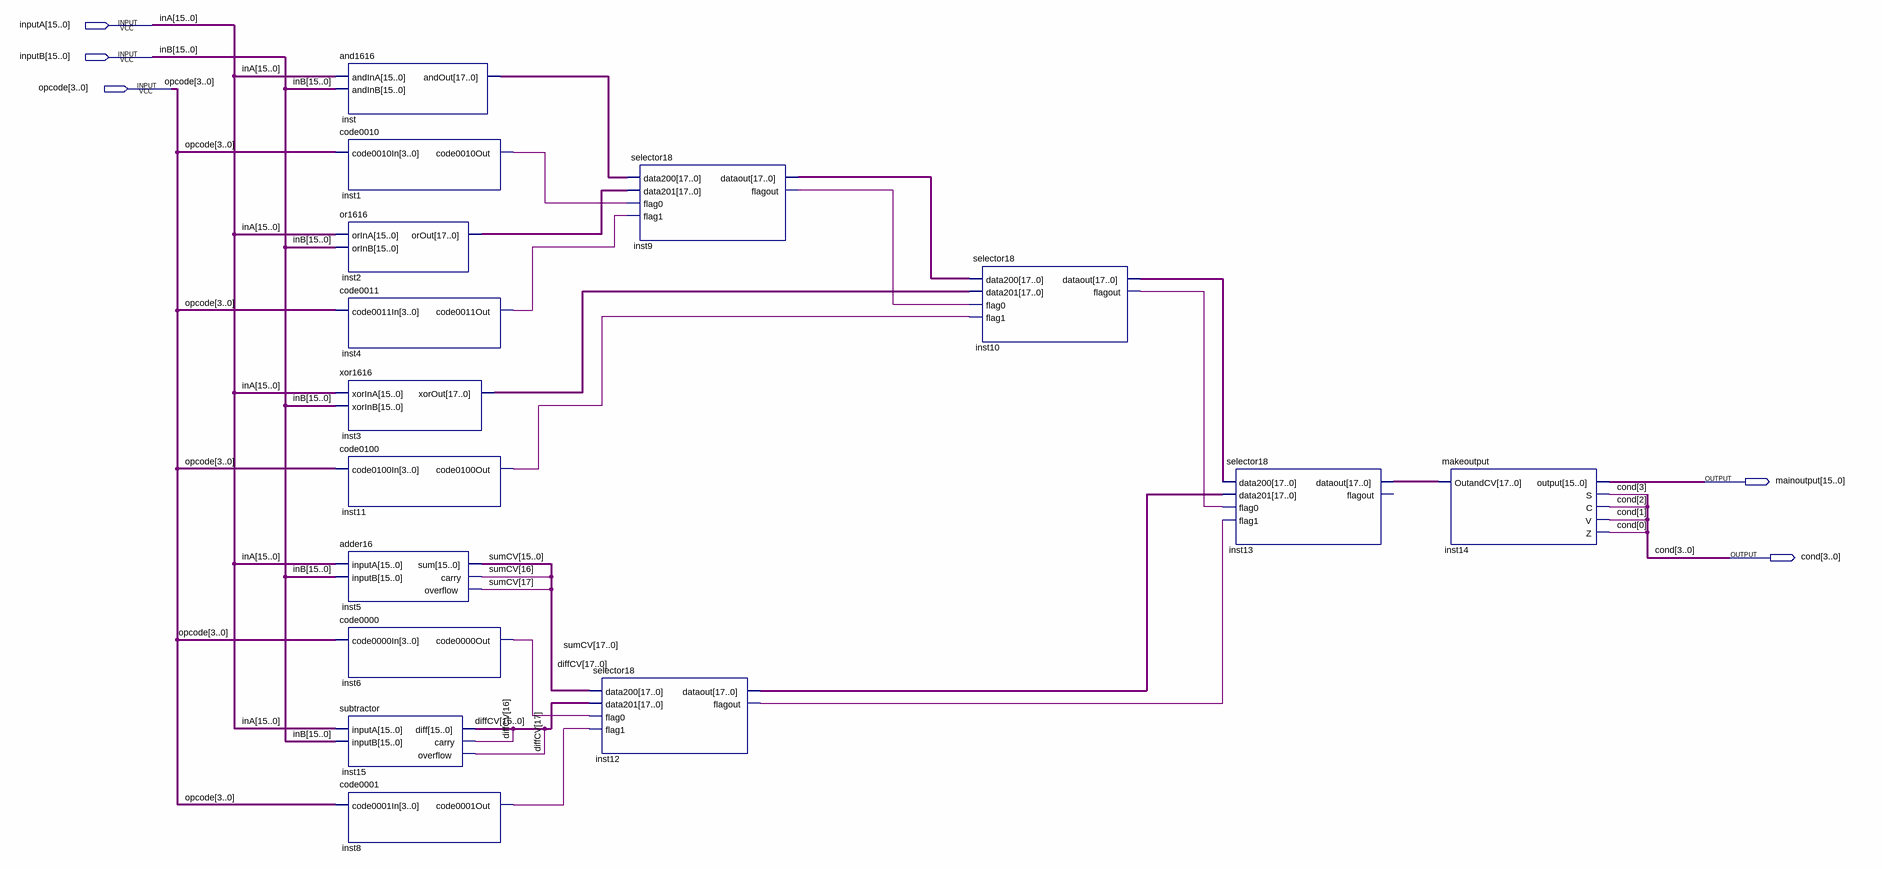
[diagram p0: schematic sheet]
// Quartus schematic main.bdf as structural Verilog: 15 symbols, 5 pins
module main (
  input  [15:0] inputA,
  input  [15:0] inputB,
  input  [3:0] opcode,
  output [15:0] mainoutput,
  output [3:0] cond
);

  wire inst1_code0010out, inst4_code0011out, inst6_code0000out, inst8_code0001out, inst9_flagout,
       inst10_flagout, inst11_code0100out, inst12_flagout;
  wire [17:0] diffCV, inst2_orout, inst3_xorout, inst9_dataout, inst10_dataout, inst12_dataout,
       inst13_dataout, inst_andout, sumCV;

  and1616 inst (.andInA(inputA), .andInB(inputB), .andOut(inst_andout));
  code0010 inst1 (.code0010In(opcode), .code0010Out(inst1_code0010out));
  or1616 inst2 (.orInA(inputA), .orInB(inputB), .orOut(inst2_orout));
  code0011 inst4 (.code0011In(opcode), .code0011Out(inst4_code0011out));
  xor1616 inst3 (.xorInA(inputA), .xorInB(inputB), .xorOut(inst3_xorout));
  code0100 inst11 (.code0100In(opcode), .code0100Out(inst11_code0100out));
  adder16 inst5 (.inputA(inputA), .inputB(inputB), .sum(sumCV[15:0]), .carry(sumCV[16]), .overflow(sumCV[17]));
  code0000 inst6 (.code0000In(opcode), .code0000Out(inst6_code0000out));
  subtractor inst15 (.inputA(inputA), .inputB(inputB), .diff(diffCV[15:0]), .carry(diffCV[16]), .overflow(diffCV[17]));
  code0001 inst8 (.code0001In(opcode), .code0001Out(inst8_code0001out));
  selector18 inst9 (
    .data200(inst_andout), .data201(inst2_orout), .flag0(inst1_code0010out), .flag1(inst4_code0011out),
    .dataout(inst9_dataout), .flagout(inst9_flagout));
  selector18 inst12 (
    .data200(sumCV), .data201(diffCV), .flag0(inst6_code0000out), .flag1(inst8_code0001out),
    .dataout(inst12_dataout), .flagout(inst12_flagout));
  selector18 inst10 (
    .data200(inst9_dataout), .data201(inst3_xorout), .flag0(inst9_flagout), .flag1(inst11_code0100out),
    .dataout(inst10_dataout), .flagout(inst10_flagout));
  selector18 inst13 (
    .data200(inst10_dataout), .data201(inst12_dataout), .flag0(inst10_flagout), .flag1(inst12_flagout),
    .dataout(inst13_dataout));  // open: flagout
  makeoutput inst14 (
    .OutandCV(inst13_dataout), .\output (mainoutput), .S(cond[3]), .C(cond[2]), .V(cond[1]), .Z(cond[0]));

  // Other names for the same wires on the sheet: inA[15:0] = inputA; inB[15:0] = inputB
endmodule
